# EAGLE schematic ina125 (EAGLE 6.4)
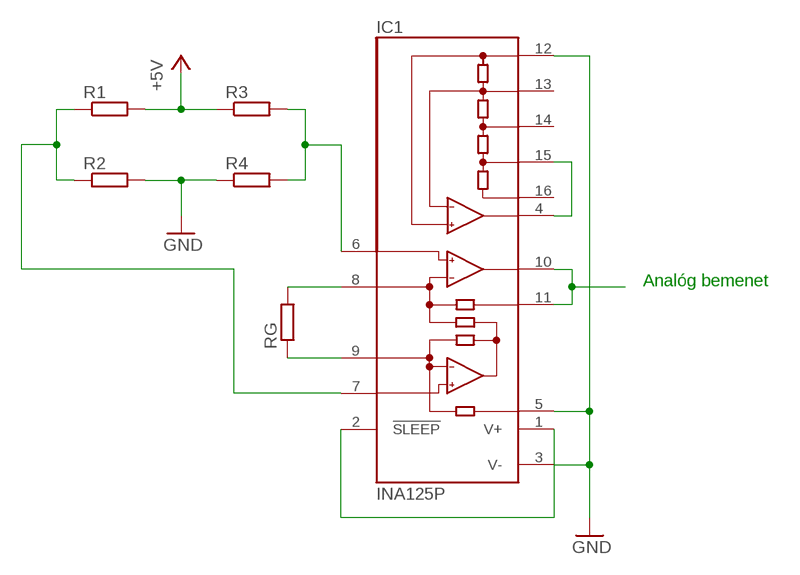
[diagram p0: schematic, sheet 1]

## Parts
IC1  INA125P  [DIL16]
R1  R-EU_0207/10  [0207/10]
R2  R-EU_0207/10  [0207/10]
R3  R-EU_0207/10  [0207/10]
R4  R-EU_0207/10  [0207/10]
RG  R-EU_0207/10  [0207/10]

## Nets
+5V: R1.2 R3.1
GND: IC1.3(V-) IC1.5(REF) IC1.12(REFCOM) R2.2 R4.1
N$1: IC1.7(-IN) R1.1 R2.1
N$2: IC1.6(+IN) R3.2 R4.2
N$5: IC1.8(RG) RG.2
N$6: IC1.9(RG) RG.1
N$7: IC1.1(V+) IC1.2(!SLEEP)
N$8: IC1.4(REFOUT) IC1.15(REF5)
N$9: IC1.10(OUT) IC1.11(SENSE)
Unconnected: IC1.13(REFBG) IC1.14(REF2.5) IC1.16(REF10)

## Notes on the sheet
- Analóg bemenet

## Library data of the parts
IC1 = burr-brown:INA125: Instrumentation Amplifier with Precision Voltage Reference; MF: TEXAS INSTRUMENT CONNECTORS; MPN: INA125P; OC_FARNELL: 1459461; OC_NEWARK: 35C1726
R1-R4 RG = rcl:R-EU_: RESISTOR, European symbol